# EasyEDA schematic schematic.easyeda.json
TITLE: IoT Traffic Lights; REV: 2.2; Date: 2021-11-01; Sheet: 1/1; Drawn By: Oliver Paraskos; Company: Oliver Paraskos
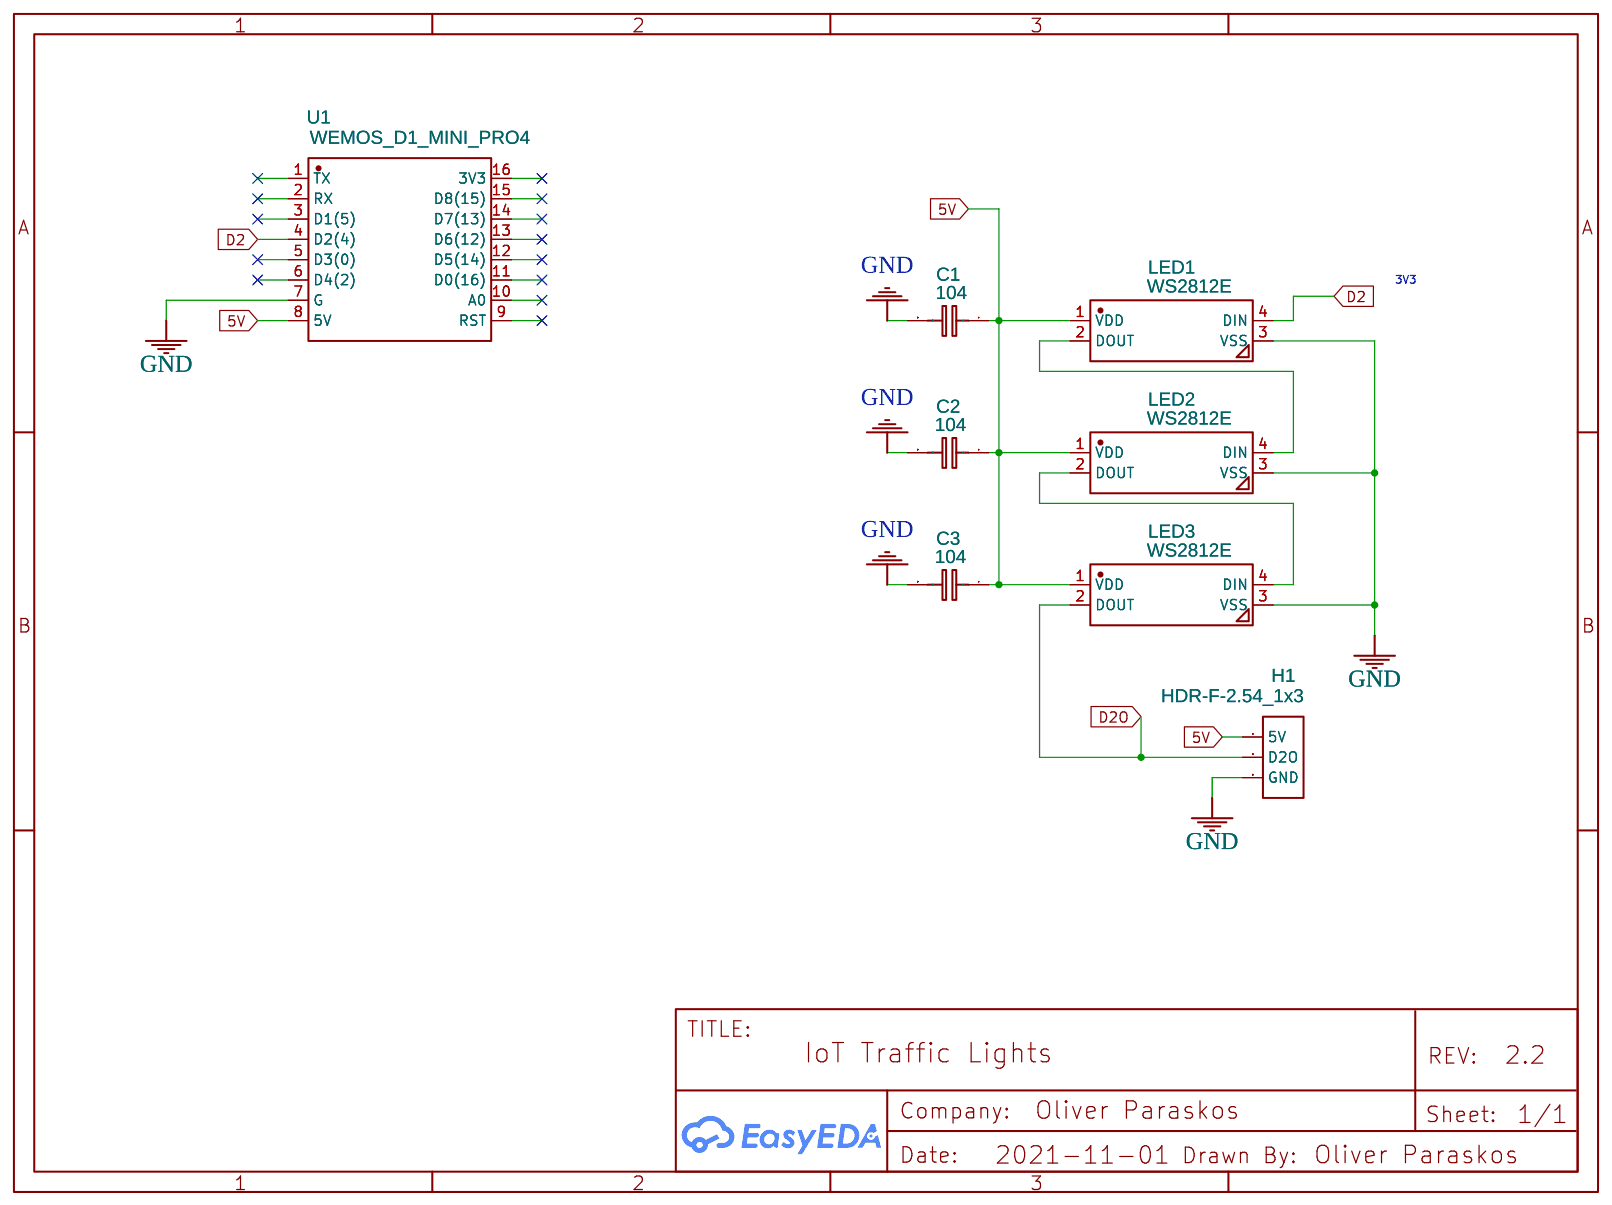
[diagram p0: schematic sheet]

## Parts
C1  104  [C1206]
C2  104  [C1206]
C3  104  [C1206]
H1  HDR-F-2.54_1x3  [HDR-F-2.54_1X3]
LED1  WS2812E  [LED-SMD_4P-L5.0-W5.0-BR]
LED2  WS2812E  [LED-SMD_4P-L5.0-W5.0-BR]
LED3  WS2812E  [LED-SMD_4P-L5.0-W5.0-BR]
U1  WEMOS_D1_MINI_PRO4  [DIP-16_WEMOS_D1_MINI_PRO4]

## Library data of the parts
C1-C3 = C_1206_EU: Contributor: LCEDA_Lib
H1 = HDR-F-2.54_1x3: Supplier Part: C146690; Supplier: LCSC; Contributor: LCEDA_Lib
LED1-LED3 = WS2812E: Supplier: LCSC; Supplier Part: C139127; Manufacturer: Worldsemi; Contributor: LCSC; JLCPCB Part Class: Extended Part
U1 = WEMOS_D1_MINI_PRO4: Supplier: LCSC; Supplier Part: C2837266; Manufacturer: null; Manufacturer Part: Wemos_D1_mini_Pro4; Contributor: LCSC; JLCPCB Part Class: Extended Part

## Nets
5V: C1.1 C2.1 C3.1 H1.1(5V) LED1.1(VDD) LED2.1(VDD) LED3.1(VDD) U1.8(5V)
GND: C1.2 C2.2 C3.2 H1.3(GND) LED1.3(VSS) LED2.3(VSS) LED3.3(VSS) U1.7(G)
D2: LED1.4(DIN) U1.4(D2(4))
D2O: H1.2(D2O) LED3.2(DOUT)
Net-(LED1-2): LED1.2(DOUT) LED2.4(DIN)
Net-(LED2-2): LED2.2(DOUT) LED3.4(DIN)

Not connected (* = marked no-connect by the designer): U1 1(TX) 2(RX) 3(D1(5)) 5(D3(0)) 6(D4(2)) 9(RST) 10(A0) 11(D0(16)) 12(D5(14)) 13(D6(12)) 14(D7(13)) 15(D8(15)) 16(3V3)

## Notes on the sheet
- 3V3
